# Altium schematic sheet RP2040_Logic_Analyzer.SchDoc
size B; SheetNumber: 1; SheetTotal: 1
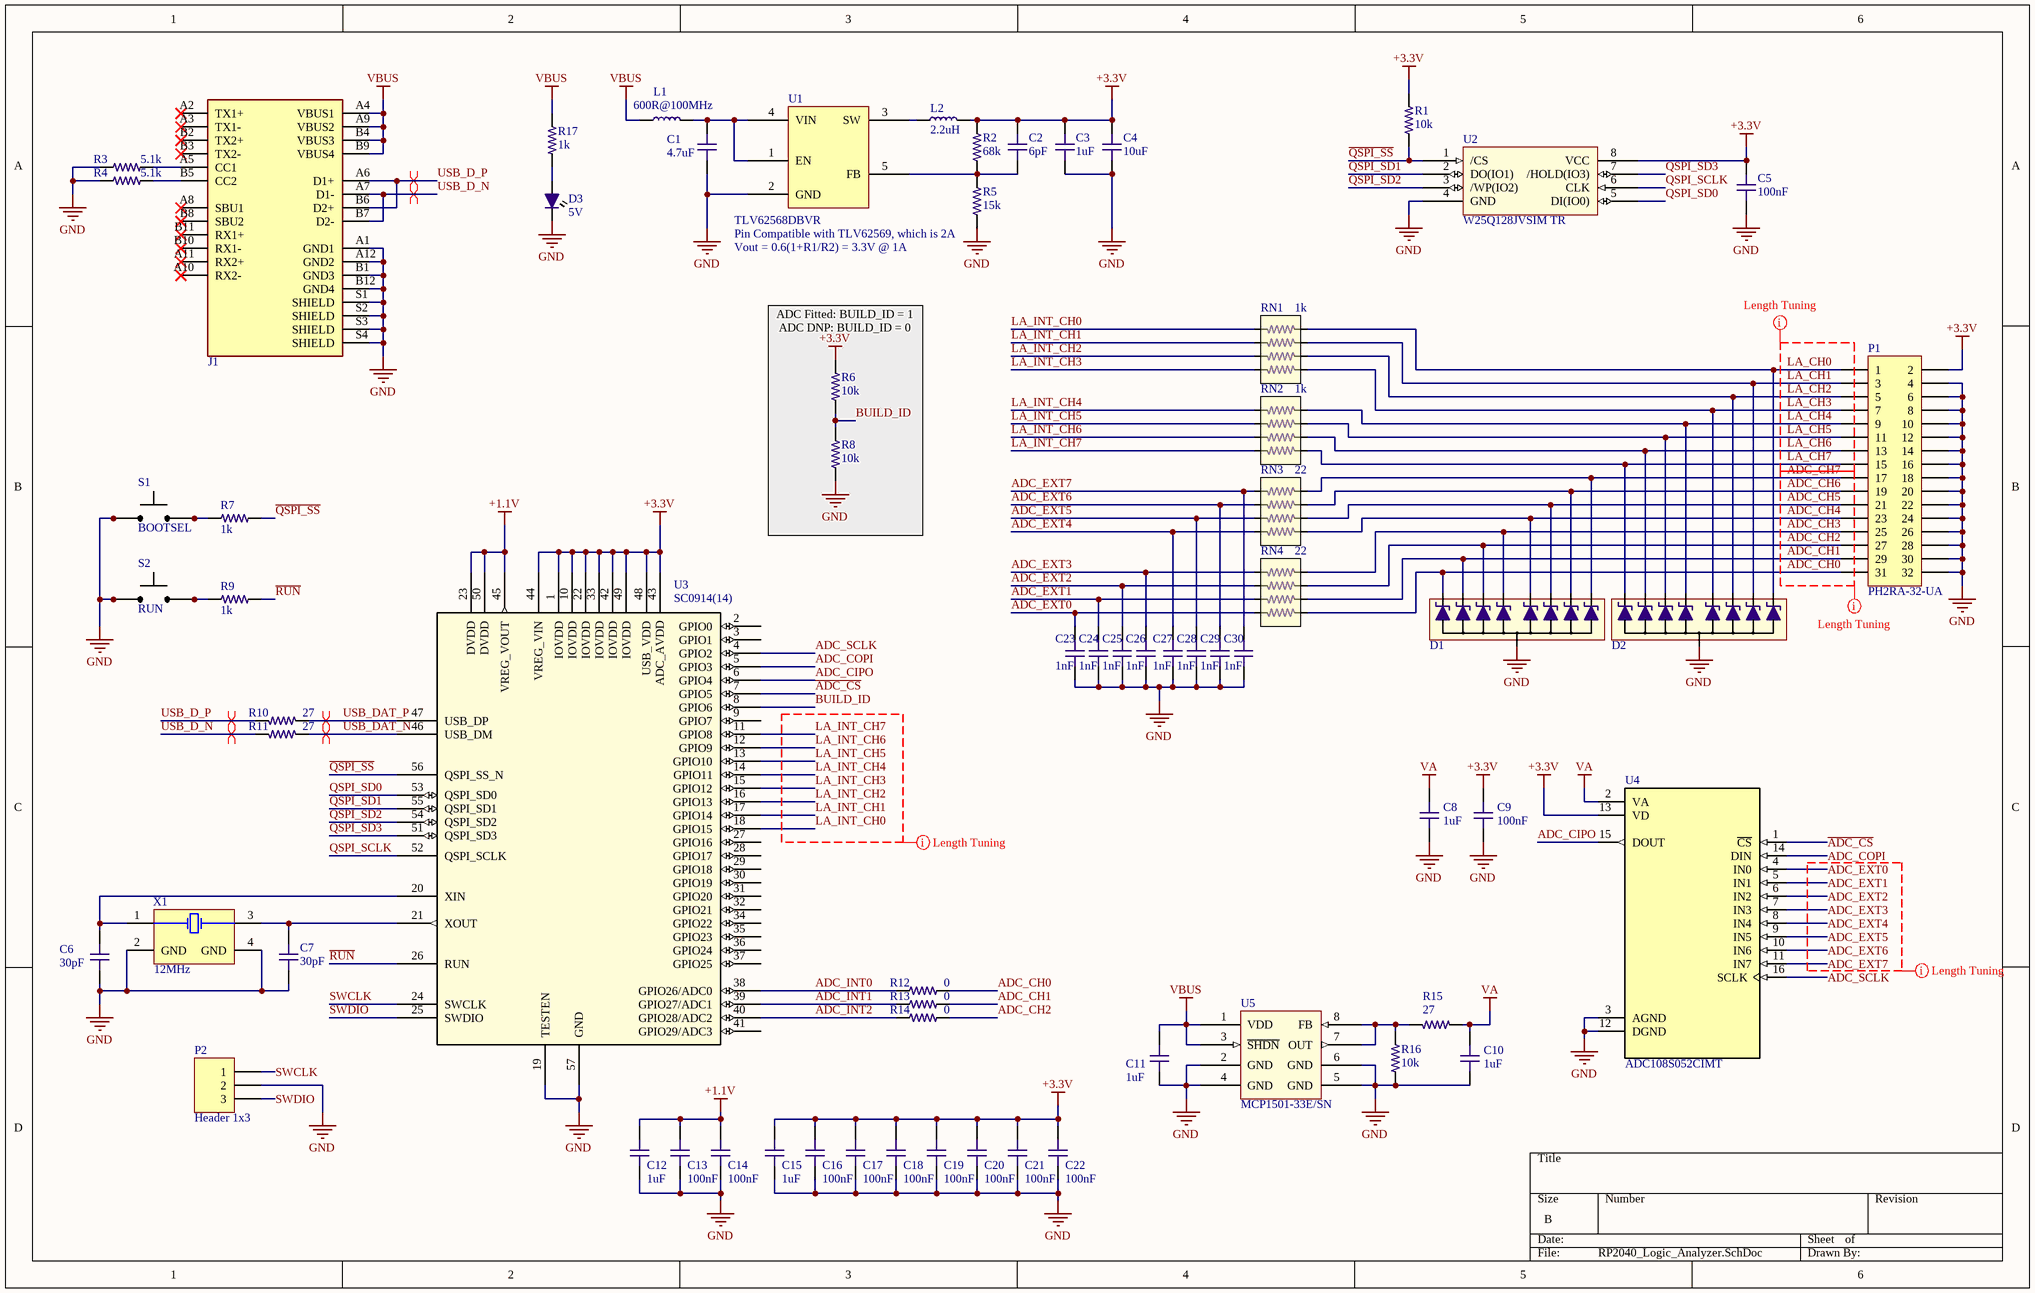
[diagram p0: RP2040_Logic_Analyzer.SchDoc]

## Parts
C1  value 4.7uF  [C0603-HIGH-DENSITY]  (hidden comment: 4.7uF, 25V, X5R, 0603)
C2  value 6pF  [C0603-HIGH-DENSITY]  (hidden comment: CL10C060DB8NNNC)
C3  value 1uF  [C0603-HIGH-DENSITY]  (hidden comment: C0603 1uF 25V X7R)
C4  value 10uF  [C0603-HIGH-DENSITY]  (hidden comment: C0603 10uF 10V X5R)
C5  value 100nF  [C0603-HIGH-DENSITY]  (hidden comment: C0603 100nF 25V X7R)
C6  value 30pF  [C0402-HIGH-DENSITY]  (hidden comment: C0402 30pF 50V C0G)
C7  value 30pF  [C0402-HIGH-DENSITY]  (hidden comment: C0402 30pF 50V C0G)
C8  value 1uF  [C0603-HIGH-DENSITY]  (hidden comment: C0603 1uF 25V X7R)
C9  value 100nF  [C0603-HIGH-DENSITY]  (hidden comment: C0603 100nF 25V X7R)
C10  value 1uF  [C0603-HIGH-DENSITY]  (hidden comment: C0603 1uF 25V X7R)
C11  value 1uF  [C0603-HIGH-DENSITY]  (hidden comment: C0603 1uF 25V X7R)
C12  value 1uF  [C0603-HIGH-DENSITY]  (hidden comment: C0603 1uF 25V X7R)
C13  value 100nF  [C0603-HIGH-DENSITY]  (hidden comment: C0603 100nF 25V X7R)
C14  value 100nF  [C0603-HIGH-DENSITY]  (hidden comment: C0603 100nF 25V X7R)
C15  value 1uF  [C0603-HIGH-DENSITY]  (hidden comment: C0603 1uF 25V X7R)
C16  value 100nF  [C0603-HIGH-DENSITY]  (hidden comment: C0603 100nF 25V X7R)
C17  value 100nF  [C0603-HIGH-DENSITY]  (hidden comment: C0603 100nF 25V X7R)
C18  value 100nF  [C0603-HIGH-DENSITY]  (hidden comment: C0603 100nF 25V X7R)
C19  value 100nF  [C0603-HIGH-DENSITY]  (hidden comment: C0603 100nF 25V X7R)
C20  value 100nF  [C0603-HIGH-DENSITY]  (hidden comment: C0603 100nF 25V X7R)
C21  value 100nF  [C0603-HIGH-DENSITY]  (hidden comment: C0603 100nF 25V X7R)
C22  value 100nF  [C0603-HIGH-DENSITY]  (hidden comment: C0603 100nF 25V X7R)
C23  value 1nF  [C0402-IPC]  (hidden comment: C0402 1nF 16V X7R)
C24  value 1nF  [C0402-IPC]  (hidden comment: C0402 1nF 16V X7R)
C25  value 1nF  [C0402-IPC]  (hidden comment: C0402 1nF 16V X7R)
C26  value 1nF  [C0402-IPC]  (hidden comment: C0402 1nF 16V X7R)
C27  value 1nF  [C0402-IPC]  (hidden comment: C0402 1nF 16V X7R)
C28  value 1nF  [C0402-IPC]  (hidden comment: C0402 1nF 16V X7R)
C29  value 1nF  [C0402-IPC]  (hidden comment: C0402 1nF 16V X7R)
C30  value 1nF  [C0402-IPC]  (hidden comment: C0402 1nF 16V X7R)
D1  ESD8008MUTAG  [UDFN14_517CN_ONS]  (value not drawn)
D2  ESD8008MUTAG  [UDFN14_517CN_ONS]  (value not drawn)
D3  5V  [LED0603-IPC]
J1  USB C  [Molex USB-C]  (value not drawn)
L1  value 600R@100MHz  [L0603]  (hidden comment: Ferrite Bead)
L2  value 2.2uH  [L1008]  (hidden comment: SDEM25201B-2R2MS)
P1  PH2RA-32-UA  [Header 2X16 THT RIGHT]
P2  Header 1x3  [HEADER 1X3 TH 2.54mm]
R1  value 10k  [R0603-IPC-10K]  (hidden comment: R0603 10K 1%)
R2  value 68k  [R0603-HIGH-DENSITY]  (hidden comment: R0603 68K 1%)
R3  value 5.1k  [R0603-IPC-5.1K]  (hidden comment: R0603 5.1K 1%)
R4  value 5.1k  [R0603-IPC-5.1K]  (hidden comment: R0603 5.1K 1%)
R5  value 15k  [R0603-HIGH-DENSITY]  (hidden comment: R0603 15K 1%)
R6  value 10k  [R0603-IPC-10K]  (hidden comment: R0603 10K 1%)
R7  value 1k  [R0603-IPC-1K]  (hidden comment: R0603 1K 1%)
R8  value 10k  [R0603-IPC-10K]  (hidden comment: R0603 10K 1%)
R9  value 1k  [R0603-IPC-1K]  (hidden comment: R0603 1K 1%)
R10  value 27  [R0603-HIGH-DENSITY]  (hidden comment: R0603 27R 1%)
R11  value 27  [R0603-HIGH-DENSITY]  (hidden comment: R0603 27R 1%)
R12  value 0  [R0402-HIGH-DENSITY]  (hidden comment: R0402 0R)
R13  value 0  [R0402-HIGH-DENSITY]  (hidden comment: R0402 0R)
R14  value 0  [R0402-HIGH-DENSITY]  (hidden comment: R0402 0R)
R15  value 27  [R0603-HIGH-DENSITY]  (hidden comment: R0603 27R 1%)
R16  value 10k  [R0603-IPC-10K]  (hidden comment: R0603 10K 1%)
R17  value 1k  [R0603-IPC-1K]  (hidden comment: R0603 1K 1%)
RN1  value 1k  [RN1206]  (hidden comment: CAY16-1001F4LF)
RN2  value 1k  [RN1206]  (hidden comment: CAY16-1001F4LF)
RN3  value 22  [RN1206]  (hidden comment: YC164-FR-0722RL)
RN4  value 22  [RN1206]  (hidden comment: YC164-FR-0722RL)
S1  BOOTSEL  [TL3342F260QG]
S2  RUN  [TL3342F260QG]
U1  TLV62568DBVR  [DBV0005A]
U2  W25Q128JVSIM TR  [SOIC127P790X216-8N]
U3  SC0914(14)  [IC57_RP2040]
U4  ADC108S052CIMT  [SOP65P640X120-16N]
U5  MCP1501-33E/SN  [SOIC127P600X175-8N]
X1  Frequency: 12MHz  [ABRACON_ABM8G_V]  (hidden comment: ABM8G-12.000MHZ-18-D2Y-T)

## Nets
+1.1V: C12.2 C13.2 C14.2 U3.23(DVDD) U3.45(VREG_VOUT) U3.50(DVDD)
+3.3V: C2.2 C3.2 C4.2 C5.2 C9.2 C15.2 C16.2 C17.2 C18.2 C19.2 C20.2 C21.2 C22.2 L2.2 P1.2 R1.2 R2.2 R6.2 U2.8(VCC) U3.1(IOVDD) U3.10(IOVDD) U3.22(IOVDD) U3.33(IOVDD) U3.42(IOVDD) U3.43(ADC_AVDD) U3.44(VREG_VIN) U3.48(USB_VDD) U3.49(IOVDD) U4.13(VD)
GND: C1.1 C3.1 C4.1 C5.1 C6.1 C7.1 C8.1 C9.1 C10.1 C11.1 C12.1 C13.1 C14.1 C15.1 C16.1 C17.1 C18.1 C19.1 C20.1 C21.1 C22.1 C23.1 C24.1 C25.1 C26.1 C27.1 C28.1 C29.1 C30.1 D1.3 D2.3 D3.K J1.A1(GND1) J1.A12(GND2) J1.B1(GND3) J1.B12(GND4) J1.S1(SHIELD) J1.S2(SHIELD) J1.S3(SHIELD) J1.S4(SHIELD) P1.4 P1.6 P1.8 P1.10 P1.12 P1.14 P1.16 P1.18 P1.20 P1.22 P1.24 P1.26 P1.28 P1.30 P1.32 P2.2 R3.1 R4.1 R5.1 R8.1 R16.1 S1.3 S1.4 S2.3 S2.4 U1.2(GND) U2.4(GND) U3.19(TESTEN) U3.57(GND) U4.3(AGND) U4.12(DGND) U5.2(GND) U5.4(GND) U5.5(GND) U5.6(GND) X1.2(GND) X1.4(GND)
VA: C8.2 C10.2 R15.1 U4.2(VA)
VBUS: C11.2 J1.A4(VBUS1) J1.A9(VBUS2) J1.B4(VBUS3) J1.B9(VBUS4) L1.1 R17.2 U5.1(VDD) U5.3(~{SHDN})
~{ADC_CS}: U3.7(GPIO5) U4.1(~{CS})
ADC_CH0: D1.1 P1.31 R12.2 RN4.5
ADC_CH1: D1.2 P1.29 R13.2 RN4.6
ADC_CH2: D1.4 P1.27 R14.2 RN4.7
ADC_CH3: D1.5 P1.25 RN4.8
ADC_CH4: D1.7 P1.23 RN3.5
ADC_CH5: D1.8 P1.21 RN3.6
ADC_CH6: D1.10 P1.19 RN3.7
ADC_CH7: D1.11 P1.17 RN3.8
ADC_CIPO: U3.6(GPIO4) U4.15(DOUT)
ADC_COPI: U3.5(GPIO3) U4.14(DIN)
ADC_EXT0: C23.2 RN4.4 U4.4(IN0)
ADC_EXT1: C24.2 RN4.3 U4.5(IN1)
ADC_EXT2: C25.2 RN4.2 U4.6(IN2)
ADC_EXT3: C26.2 RN4.1 U4.7(IN3)
ADC_EXT4: C27.2 RN3.4 U4.8(IN4)
ADC_EXT5: C28.2 RN3.3 U4.9(IN5)
ADC_EXT6: C29.2 RN3.2 U4.10(IN6)
ADC_EXT7: C30.2 RN3.1 U4.11(IN7)
ADC_INT0: R12.1 U3.38(GPIO26/ADC0)
ADC_INT1: R13.1 U3.39(GPIO27/ADC1)
ADC_INT2: R14.1 U3.40(GPIO28/ADC2)
ADC_SCLK: U3.4(GPIO2) U4.16(SCLK)
BUILD_ID: R6.1 R8.2 U3.8(GPIO6)
LA_CH0: D2.11 P1.1 RN1.4
LA_CH1: D2.10 P1.3 RN1.3
LA_CH2: D2.8 P1.5 RN1.2
LA_CH3: D2.7 P1.7 RN1.1
LA_CH4: D2.5 P1.9 RN2.4
LA_CH5: D2.4 P1.11 RN2.3
LA_CH6: D2.2 P1.13 RN2.2
LA_CH7: D2.1 P1.15 RN2.1
LA_INT_CH0: RN1.5 U3.18(GPIO15)
LA_INT_CH1: RN1.6 U3.17(GPIO14)
LA_INT_CH2: RN1.7 U3.16(GPIO13)
LA_INT_CH3: RN1.8 U3.15(GPIO12)
LA_INT_CH4: RN2.5 U3.14(GPIO11)
LA_INT_CH5: RN2.6 U3.13(GPIO10)
LA_INT_CH6: RN2.7 U3.12(GPIO9)
LA_INT_CH7: RN2.8 U3.11(GPIO8)
~{QSPI_SS}: R1.1 R7.2 U2.1(/CS) U3.56(QSPI_SS_N)
QSPI_SCLK: U2.6(CLK) U3.52(QSPI_SCLK)
QSPI_SD0: U2.5(DI(IO0)) U3.53(QSPI_SD0)
QSPI_SD1: U2.2(DO(IO1)) U3.55(QSPI_SD1)
QSPI_SD2: U2.3(/WP(IO2)) U3.54(QSPI_SD2)
QSPI_SD3: U2.7(/HOLD(IO3)) U3.51(QSPI_SD3)
~{RUN}: R9.2 U3.26(RUN)
SWCLK: P2.1 U3.24(SWCLK)
SWDIO: P2.3 U3.25(SWDIO)
USB_D_N: J1.A7(D1-) J1.B7(D2-) R11.2
USB_D_P: J1.A6(D1+) J1.B6(D2+) R10.2
USB_DAT_N: R11.1 U3.46(USB_DM)
USB_DAT_P: R10.1 U3.47(USB_DP)
NetC1_2: C1.2 L1.2 U1.1(EN) U1.4(VIN)
NetC2_1: C2.1 R2.1 R5.2 U1.5(FB)
NetC6_2: C6.2 U3.20(XIN) X1.1(X1)
NetC7_2: C7.2 U3.21(XOUT) X1.3(X2)
NetD3_A: D3.A R17.1
NetJ1_A5: J1.A5(CC1) R3.2
NetJ1_B5: J1.B5(CC2) R4.2
NetL2_1: L2.1 U1.3(SW)
NetR7_1: R7.1 S1.1 S1.2
NetR9_1: R9.1 S2.1 S2.2
NetR15_2: R15.2 R16.2 U5.7(OUT) U5.8(FB)

Not connected (* = marked no-connect by the designer): J1 A2(TX1+)* A3(TX1-)* A8(SBU1)* A10(RX2-)* A11(RX2+)* B2(TX2+)* B3(TX2-)* B8(SBU2)* B10(RX1-)* B11(RX1+)*; U3 2(GPIO0) 3(GPIO1) 9(GPIO7) 27(GPIO16) 28(GPIO17) 29(GPIO18) 30(GPIO19) 31(GPIO20) 32(GPIO21) 34(GPIO22) 35(GPIO23) 36(GPIO24) 37(GPIO25) 41(GPIO29/ADC3)

## Layout directives
differential pair: USB_D_P
differential pair; differential pair class USB: USB_D_N, USB_D_P, USB_DAT_N, USB_DAT_P
net class LA_INT: LA_INT_CH0, LA_INT_CH1, LA_INT_CH2, LA_INT_CH3, LA_INT_CH4, LA_INT_CH5, LA_INT_CH6, LA_INT_CH7
net class LA_CH: LA_CH0, LA_CH1, LA_CH2, LA_CH3, LA_CH4, LA_CH5, LA_CH6, LA_CH7
net class ADC_CH: ADC_CH0, ADC_CH1, ADC_CH2, ADC_CH3, ADC_CH4, ADC_CH5, ADC_CH6, ADC_CH7
net class ADC_EXT: ADC_EXT0, ADC_EXT1, ADC_EXT2, ADC_EXT3, ADC_EXT4, ADC_EXT5, ADC_EXT6, ADC_EXT7

## Notes on the sheet
- (near R5) Pin Compatible with TLV62569, which is 2A
- Vout = 0.6(1+R1/R2) = 3.3V @ 1A
- ADC Fitted: BUILD_ID = 1
  ADC DNP: BUILD_ID = 0

## Library data of the parts
C1 = C0603 4.7uF 25V X5R: Chip Capacitor, 0603, 4.7uF, 25V, X5R; EIA Code: X5R; Max. Voltage: 25V; Supplier 1: Digi-Key; Supplier 2: Mouser; Supplier 3: LCSC; Supplier Part Number 1: 490-7203-1-ND; Supplier Part Number 2: 81-GRM188R61E475KE1D; Supplier Part Number 3: C90057
C2 = C0603 6pF 50V C0G: CAP CER 6PF 50V C0G/NP0 0603; EIA Code: C0G; Max. Voltage: 50V; Supplier 1: Digi-Key; Supplier 2: Mouser; Supplier 3: LCSC; Supplier Part Number 1: 1276-2134-1-ND; Supplier Part Number 2: 187-CL10C060DB8NNNC; Supplier Part Number 3: C170142
C3 C8 C10-C12 C15 = C0603 1uF 25V X7R: CAP CER 1UF 25V X7R 0603; EIA Code: X7R; Max. Voltage: 25V; Features: Soft Termination; Supplier 1: Digi-Key; Supplier Part Number 1: 445-173615-1-ND
C4 = C0603 10uF 10V X5R: Chip Capacitor, 0603, 10uF, 10V, X5R; EIA Code: X7R; Max. Voltage: 10V; Supplier 1: Digi-Key; Supplier Part Number 1: 490-10474-1-ND
C5 C9 C13 C14 C16-C22 = C0603 100nF 25V X7R: Chip Capacitor, 0603, 100nF, 25V, X7R; EIA Code: X7R; Max. Voltage: 25V; Supplier 1: Digi-Key; Supplier Part Number 1: 490-1524-1-ND
C6 C7 = C0402 30pF 50V C0G: Chip Capacitor, 0402, 30pF, 2%, 50V, C0G; Max. Voltage: 50V; Supplier 1: Digi-Key; EIA Code: C0G; Supplier Part Number 1: 490-8198-1-ND
C23-C30 = C0402 1nF 16V X7R: Chip Capacitor, 0402, 1nF, 25V, X7R; EIA Code: X5R; Max. Voltage: 16V; Supplier 1: Digi-Key; Supplier Part Number 1: 311-1352-1-ND
D1 D2 = ESD8008MUTAG: 8.1V (Typ) Clamp 16A Ipp Tvs Diode Surface Mount 14-UDFN (5.5x1.5); Supplier 1: Digi-Key; Supplier 2: Mouser; Supplier Part Number 1: ESD8008MUTAGOSCT-ND; Supplier Part Number 2: 863-ESD8008MUTAG
D3 = LED 0603 Green: LED GREEN CLEAR 0603 SMD; Supplier 1: Digi-Key; Supplier Part Number 1: 732-4971-1-ND
J1 = USB C: USB-C USB 3.1 Gen 2, Superspeed+_ Receptacle Connector 24 Position Surface Mount, Right Angle; Through Hole; MF: Molex; MP: 1054500101; Package: None; Digi-Key_Part_Number: WM12856CT-ND; SnapEDA_Link: https://www.snapeda.com/parts/1054500101/Molex/view-part/448528/?ref=snap; Digi-Key_Purchase_URL: https://www.digikey.tw/product-detail/en/molex/1054500101/WM12856CT-ND/5843891?utm_source=snapeda&utm_medium=aggregator&utm_campaign=symbol; Value: *; Supplier 1: Digi-Key; Supplier 2: Mouser; Supplier 3: LCSC; Supplier Part Number 1: WM12856CT-ND; Supplier Part Number 2: 538-105450-0101; Supplier Part Number 3: C134092
L1 = FB 0603 600R @ 100MHz: 600 Ohms @ 100MHz 1 Ferrite Bead 0603 (1608 Metric) 500mA 380mOhm; Supplier 1: Digi-Key; Supplier Part Number 1: 490-1014-1-ND
L2 = SDEM25201B-2R2MS: 2.2µH Shielded Inductor 2.05A 117mOhm Max 1008 (2520 Metric); Supplier 1: Digi-Key; Supplier Part Number 1: 2037-SDEM25201B-2R2MSCT-ND
P1 = Header 16X2 Right Angle: Header, 16-Pin, Dual row, Right Angle; Supplier 1: Digi-Key; Supplier Part Number 1: 2057-PH2RA-32-UA-ND
P2 = Header 1x3: Header, 3-Pin; LatestRevisionDate: 17-Jul-2002; LatestRevisionNote: Re-released for DXP Platform.; Publisher: Altium Limited
R1 R6 R8 R16 = R0603 10K 1%: RES SMD 10K OHM 1% 1/10W 0603; Supplier 1: Digi-Key; Supplier Part Number 1: RMCF0603FT10K0CT-ND
R2 = R0603 68K 0.1%: RES SMD 68K OHM 1% 1/5W 0603; Supplier 1: Digi-Key; Supplier Part Number 1: P20181CT-ND
R3 R4 = R0603 5.1K 1%: RES SMD 5.1K OHM 1% 1/10W 0603; Temperature Coefficient: ±100ppm/°C; Features: Automotive AEC-Q200; Operating Temperature: -55°C ~ 155°C; Supplier 1: Digi-Key; Supplier Part Number 1: RMCF0603FT5K10CT-ND
R5 = R0603 15K 1%: RES SMD 15K OHM 1% 1/10W 0603; Supplier 1: Digi-Key; Supplier Part Number 1: RMCF0603FT15K0CT-ND
R7 R9 R17 = R0603 1K 1%: RES SMD 1K OHM 1% 1/10W 0603; Temperature Coefficient: ±100ppm/°C; Operating Temperature: -55°C ~ 155°C; Features: Automotive AEC-Q200; Tolerance: ±1%; Supplier 1: Digi-Key; Supplier Part Number 1: RMCF0603FG1K00CT-ND
R10 R11 R15 = R0603 27R 1%: RES SMD 27 OHM 1% 1/10W 0603; Supplier 1: Digi-Key; Supplier Part Number 1: RMCF0603FT27R0CT-ND
R12-R14 = R0402 0R: Chip Resistor, 0402, 0 ohm jumper; Supplier 1: Digi-Key; Supplier Part Number 1: 311-0.0JRCT-ND
RN1 RN2 = RN1206 1K 1%: 1k Ohm ±1% 62.5mW Power Per Element Isolated 4 Resistor Network/Array ±200ppm/°C 1206 (3216 Metric), Convex, Long Side Terminals; Supplier 1: Digi-Key; Supplier 2: Mouser; Supplier Part Number 1: CAY16-1001F4LFCT-ND; Supplier Part Number 2: 652-CAY16-1001F4LF
RN3 RN4 = RN1206 22R 1%: 22 Ohm ±1% 62.5mW Power Per Element Isolated 4 Resistor Network/Array ±200ppm/°C 1206 (3216 Metric), Convex, Long Side Terminals; Supplier 1: Digi-Key; Supplier 2: Mouser; Supplier Part Number 1: 13-YC164-FR-0722RLCT-ND; Supplier Part Number 2: 603-YC164-FR-0722RL
S1 S2 = SWITCH TACTILE SPST: SWITCH TACTILE SPST-NO 0.05A 12V; Manufacturer Part Number: TL3342F260QG; Supplier 1: Digi-Key; Supplier Part Number 1: EG5470CT-ND
U1 = TLV62568: IC REG BUCK ADJ 1A SOT23-5; Supplier 1: Digi-Key; Supplier Part Number 1: 296-47359-1-ND
U2 = W25Q128JV: NOR Flash spiFlash, 3V, 128M-bit, 4Kb Uniform Sector, DTR; Supplier 1: Digi-Key; Supplier Part Number 1: W25Q128JVSIMCT-ND; Supplier 2: Mouser; Supplier Part Number 2: 454-W25Q128JVSIMTR
U3 = RP2040: ARM® Cortex®-M0+ series Microcontroller IC 32-Bit Dual-Core 133MHz 16MB (16M x 8) FLASH 56-QFN (7x7); Manufacturer: Raspberry Pi; Manufacturer Part Number: SC0908(13); Supplier 1: Digi-Key; Supplier Part Number 1: 2648-SC0908(13)CT-ND
U4 = ADC108S052CIMT: 10 Bit Analog to Digital Converter 8 Input 1 SAR 16-TSSOP; Supplier 1: Digi-Key; Supplier 2: Mouser; Supplier Part Number 1: ADC108S052CIMT/NOPB-ND; Supplier Part Number 2: 926-AD108S052CIMTNPB
U5 = MCP1501-33E/SN: Series Voltage Reference IC Fixed 3.3V V ±0.1% 20 mA 8-SOIC; Supplier 1: Digi-Key; Supplier 2: Mouser; Supplier Part Number 1: MCP1501-33E/SN-ND; Supplier Part Number 2: 579-MCP1501-33E/SN
X1 = CMP-2000-05039-1: Ultra Miniature Ceramic Glass Sealed SMD Cryastal, 12 MHz, 18 pF, +/- 20 ppm, -40 to 85 degC, 4-Pin SMD, RoHS, Tape and Reel; Brand: ABRACON; ESR: 120Ohms; Case Length: 3.2mm; Tolerance: 20PPM; Frequency Stability: 30PPM; Case Height: 1mm; Case Width: 2.5mm; Load Capacitance: 18pF; Termination Style: SMD/SMT; Mounting Style: SMD/SMT; Factory Pack Quantity: 1000; Series: ABM8G; Datasheet Version: Apr-17; Manufacturer: ABRACON; Packaging: Reel; Manufacturer URL: http://www.abracon.com/; RoHS: Details; Package / Case: 3.2mmx2.5mm; Type: UltraMiniatureGlassSealedCrystal; Datasheet URL: https://datasheet.ciiva.com/15116/getdatasheetpartid-719790-15116701.pdf; Operating Temperature Range: -40Cto+85C; Product Category: Crystals; Dimensions: 2.5mmWx3.2mmLx1mmH